# EAGLE design at85prog (EAGLE 7.2.0)
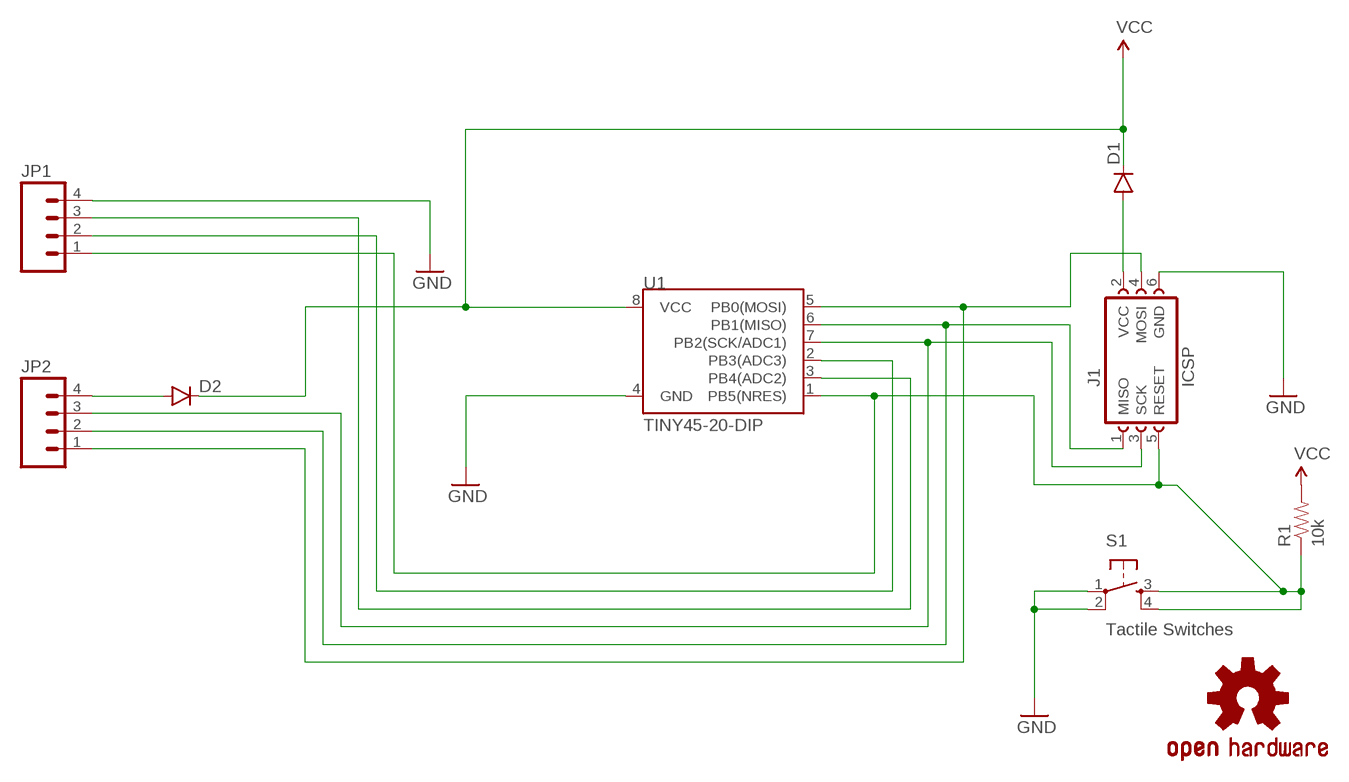
[diagram p0: schematic, sheet 1]

## Parts
D1  DIODESMB  [SMB-DIODE]
D2  DIODESMB  [SMB-DIODE]
J1  ICSP  AVRPRGSTANDARD  [2X3]
JP1  M04PTH  [1X04]
JP2  M04PTH  [1X04]
LOGO1  OSHW-LOGOS  [OSHW-LOGO-S]
R1  10k  RESISTOR1206  [1206]
S1  Tactile Switches  TAC_SWITCHSMD  [TACTILE-SWITCH-SMD]
U1  TINY45-20-DIP  ATTINY45TINY45-20-DIP  [DIP08]

## Nets
GND: J1.6(GND) JP1.4 S1.1 S1.2
N$1: J1.4(MOSI) JP2.1 U1.5(PB0(MOSI))
N$2: J1.1(MISO) JP2.2 U1.6(PB1(MISO))
N$3: J1.3(SCK) JP2.3 U1.7(PB2(SCK/ADC1))
N$4: J1.5(RESET) JP1.1 R1.1 S1.3 S1.4 U1.1(PB5(NRES))
N$6: JP1.2 U1.2(PB3(ADC3))
N$7: U1.4(GND) ; supply symbol labelled GND
N$8: JP1.3 U1.3(PB4(ADC2))
N$9: D1.A J1.2(VCC)
N$10: D2.A JP2.4
VCC: D1.C D2.C R1.2 U1.8(VCC)

## Library data of the parts
D1 D2 = SparkFun-DiscreteSemi:DIODE: Diode These are standard reverse protection diodes and small signal diodes. SMA package can handle up to about 1A. SOD-323 can handle about 200mA. What the SOD-323 package when ordering, there are some mfgs out there that are 5-pin packages.; PROD_ID: DIO-09646
J1 = gipi:AVRPRG
JP1 JP2 = SparkFun-Connectors:M04: Header 4 Standard 4-pin 0.1" header. Use with straight break away headers (SKU : PRT-00116), right angle break away headers (PRT-00553), swiss pins (PRT-00743), machine pins (PRT-00117), and female headers (PRT-00115). Molex polarized connector foot print use with SKU : PRT-08231 with associated crimp pins and housings. 1MM SMD Version SKU: PRT-10208
LOGO1 = SparkFun-Aesthetics:OSHW-LOGO: Open Source Hardware Logo This logo indicates the piece of hardware it is found on incorporates a OSHW license and/or adheres to the definition of open source hardware found here: http://freedomdefined.org/OSHW
R1 = SparkFun-Passives:RESISTOR: Resistor Basic schematic elements and footprints for 0603, 1206, and PTH resistors.
S1 = gipi:TAC_SWITCH: Momentary Switch Button commonly used for reset or general input. Digikey part number: CKN9104CT-ND; PROD_ID: CKN9104CT-ND
U1 = SparkFun-DigitalIC:ATTINY45: Atmel 8-pin 2/4/8kB flash uC; PROD_ID: IC-09439

## Board
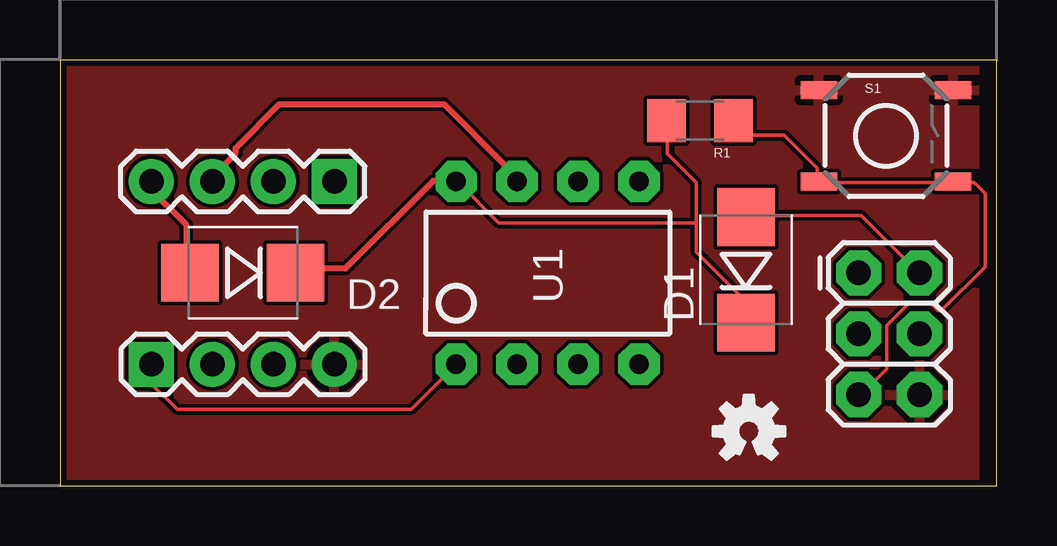
[diagram p1: board, top side]
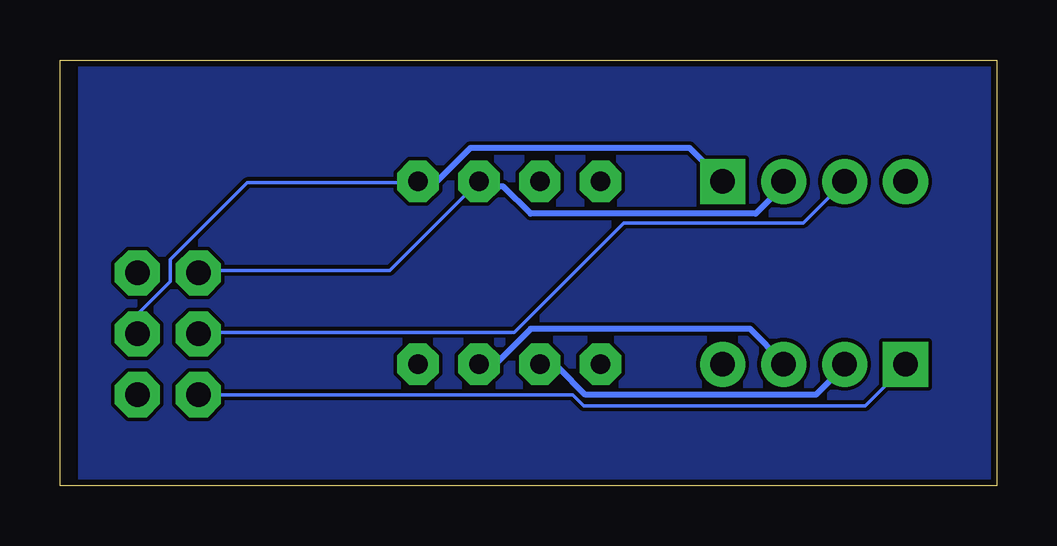
[diagram p2: board, bottom side, seen from below]

Size 39.04 x 17.77 mm. Coordinates in mm from the lower left corner, seen from the top.
Outline: 0,0 39.04,0 39.04,17.77 0,17.77 0,0
Copper layers (1*16): Top 0.035mm / dielectric 1.5mm / Bottom 0.035mm
Design rules "SeeedStudio_2layer_DRU_no_angle_20140221": minimum track width 6mil, minimum drill 12mil, track to track 6mil, track to pad 6mil, pad to pad 6mil, via to via 6mil, smd to smd 0mil, copper to edge 10mil, drill to drill 10mil, minimum pad ring 10mil, minimum via ring 6mil, stop-mask expansion 2mil, vias tented up to drill 100mil, thermal gap 10mil

### Footprints (pad centres in the part's own frame; a part is rotated, then mirrored left to right if it is on the bottom)
SMB-DIODE = smd 2.4 x 2.4: A 2.2,0; C -2.2,0
2X3 = drill 1.016 pad 1.88 octagon: 1 0,0; 2 0,2.54; 3 2.54,0; 4 2.54,2.54; 5 5.08,0; 6 5.08,2.54
1X04 = drill 1.016 pad 1.88 square: 1 0,0 | drill 1.016 pad 1.88: 2 2.54,0; 3 5.08,0; 4 7.62,0
1206 = smd 1.6 x 1.8: 1 -1.4,0; 2 1.4,0
TACTILE-SWITCH-SMD = smd 1.524 x 0.762: 1 -2.794,1.905; 2 2.794,1.905; 3 -2.794,-1.905; 4 2.794,-1.905
DIP08 = drill 0.813 pad 1.727 octagon: 1 -3.81,-3.81; 2 -1.27,-3.81; 3 1.27,-3.81; 4 3.81,-3.81; 5 3.81,3.81; 6 1.27,3.81; 7 -1.27,3.81; 8 -3.81,3.81

### Placement (x,y rotation side)
D1  28.57,9.02 90 top
D2  7.62,8.89 180 top
J1  33.27,8.89 270 top
JP1  3.81,5.08 0 top
JP2  11.43,12.7 180 top
LOGO1  28.7,2.29 0 top
R1  26.67,15.24 180 top
S1  34.42,14.61 0 top
U1  20.32,8.89 0 top

### Tracks (layer width: path | path; a pad name or v marks a point on that pad's centre or on a via)
GND
  pour Top: 0,17.78 38.1,17.78 38.1,0 0,0
N$1
  Bottom 0.152: J1.4 35.81,7.16 34.44,8.53 34.44,9.45 31.24,12.65 24.23,12.65 U1.5
  Bottom 0.254: U1.5 24,12.73 23.32,12.73 21.95,14.1 12.8,14.1 11.43,12.73 JP2.1
N$2
  Bottom 0.152: U1.6 25.3,8.99 33.22,8.99 J1.1
  Bottom 0.254: U1.6 21.49,12.5 20.57,12.5 19.43,11.35 10.06,11.35 8.91,12.5 JP2.2
N$3
  Top 0.254: U1.7 18.97,12.73 18.52,13.18 18.52,13.41 16,15.93 9.14,15.93 7.32,14.1 7.32,13.87 6.17,12.73 JP2.3
  Bottom 0.152: JP2.3 8.08,10.97 15.54,10.97 20.12,6.4 33.22,6.4 J1.3
N$4
  Top 0.152: U1.1 14.63,3.2 4.88,3.2 3.81,4.27 JP1.1 | R1.1 28.19,15.24 28.8,14.63 30.18,14.63 31.55,13.26 31.55,12.8 S1.3 31.7,12.65 37.19,12.65 S1.4 37.34,12.65 38.1,12.65 38.56,12.19 38.56,9.14 36.73,7.31 36.58,7.31 36.27,7.62 35.36,7.62 34.44,6.71 34.44,4.88 33.38,3.81 J1.5
  Bottom 0.152: J1.5 17.68,3.81 17.22,3.35 5.49,3.35 3.81,5.03 JP1.1
N$5
  pour Bottom: 0,17.78 38.1,17.78 38.1,0 0,0
N$6
  Bottom 0.254: U1.2 18.97,4.95 18.29,4.95 17.14,3.81 7.54,3.81 6.4,4.95 JP1.2
N$8
  Bottom 0.254: U1.3 21.49,5.18 20.8,5.18 19.43,6.55 10.29,6.55 8.91,5.18 JP1.3
N$9
  Top 0.152: D1.A 28.65,11.28 33.38,11.28 35.81,8.84 J1.2
N$10
  Top 0.254: D2.A 5.26,9.07 5.26,10.9 3.66,12.5 JP2.4
VCC
  Top 0.152: 26.52,10.97 26.52,9.75 28.5,7.77 28.5,6.86 D1.C | 26.52,10.97 26.52,12.65 25.3,13.87 25.3,15.24 R1.2 | 26.52,10.97 18.29,10.97 16.61,12.65 U1.8
  Top 0.254: D2.C 9.83,9.07 11.89,9.07 15.54,12.73 16.46,12.73 U1.8

### Text on the board
tDocu: VCC | PB2 | PB1 | PB0 | PB5 | PB3 | PB4 | GND